# EAGLE design TXB0108PWR (EAGLE 7.1.0)
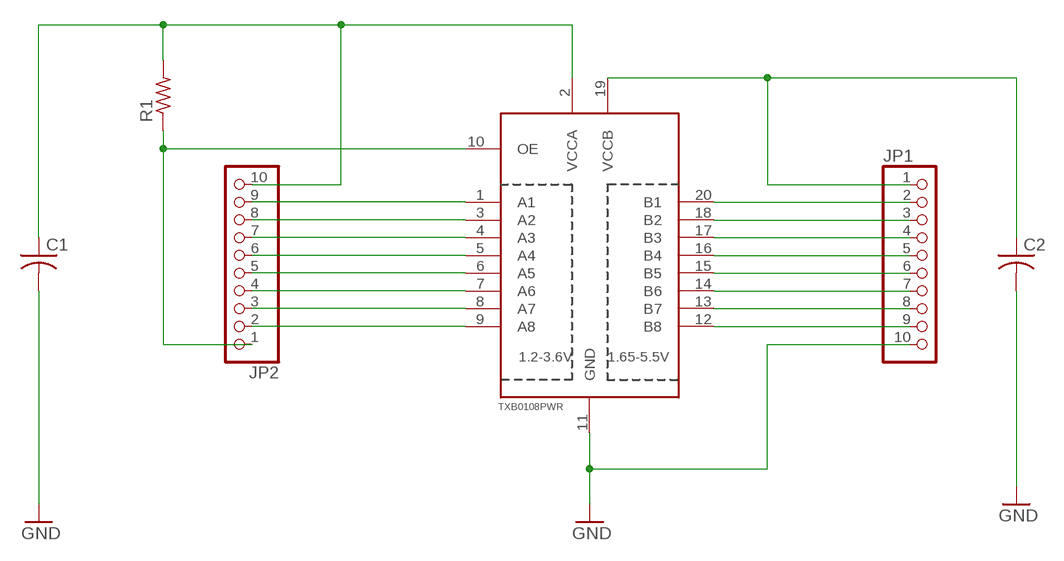
[diagram p0: schematic, sheet 1]

## Parts
C1  C-USC0603  [C0603]
C2  C-USC0603  [C0603]
JP1  PINHD-1X10  [1X10]
JP2  PINHD-1X10  [1X10]
R1  R-US_R0603  [R0603]
U$1  TXB0108PWR  [TXB0108PWR]

## Nets
B1: JP1.2 U$1.20(B1)
B2: JP1.3 U$1.18(B2)
B3: JP1.4 U$1.17(B3)
B4: JP1.5 U$1.16(B4)
B5: JP1.6 U$1.15(B5)
B6: JP1.7 U$1.14(B6)
B7: JP1.8 U$1.13(B7)
B8: JP1.9 U$1.12(B8)
GND: C1.2 C2.2 JP1.10 U$1.11(GND)
N$7: JP2.9 U$1.1(A1)
N$13: JP2.8 U$1.3(A2)
N$14: JP2.7 U$1.4(A3)
N$15: JP2.6 U$1.5(A4)
N$16: JP2.5 U$1.6(A5)
N$17: JP2.4 U$1.7(A6)
N$18: JP2.3 U$1.8(A7)
N$19: JP2.2 U$1.9(A8)
OE: JP2.1 R1.1 U$1.10(OE)
VCCA: C1.1 JP2.10 R1.2 U$1.2(VCCA)
VCCB: C2.1 JP1.1 U$1.19(VCCB)

## Library data of the parts
C1 C2 = rcl:C-US: CAPACITOR, American symbol
JP1 JP2 = pinhead:PINHD-1X10: PIN HEADER
R1 = rcl:R-US_: RESISTOR, American symbol
U$1 = TXB0108PWR:TXB0108PWR

## Board
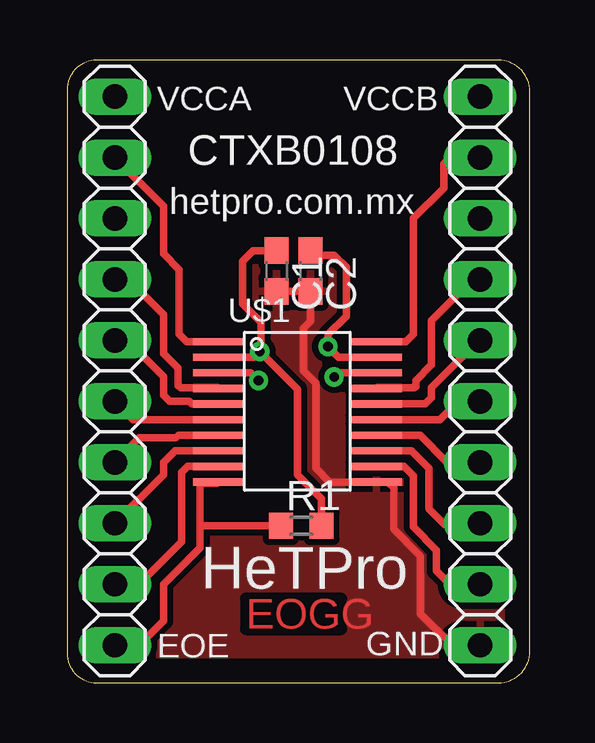
[diagram p1: board, top side]
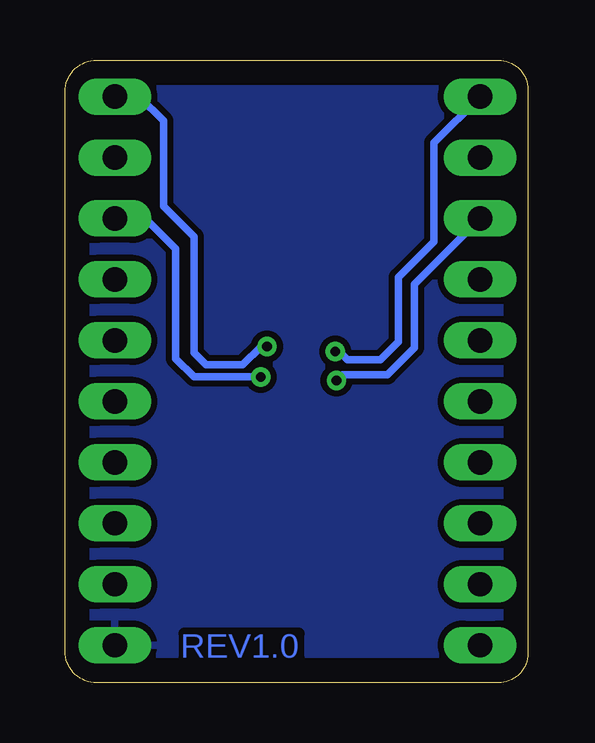
[diagram p2: board, bottom side, seen from below]

Size 19.29 x 25.94 mm. Coordinates in mm from the lower left corner, seen from the top.
Outline: 19.29,1.31 19.29,24.63 arc90 17.98,25.94 1.22,25.94 arc90 0,24.72 0,1.22 arc90 1.22,0 17.98,0 arc90 19.29,1.31
Copper layers (1*16): Top 0.035mm / dielectric 1.5mm / Bottom 0.035mm
Design rules "default": minimum track width 10mil, minimum drill 24mil, track to track 8mil, track to pad 8mil, pad to pad 8mil, via to via 8mil, smd to smd 8mil, copper to edge 40mil, drill to drill 8mil, minimum pad ring 10mil, minimum via ring 8mil, stop-mask expansion 4mil, vias tented up to drill 0mil, thermal gap 10mil

### Footprints (pad centres in the part's own frame; a part is rotated, then mirrored left to right if it is on the bottom)
C0603 = smd 1.1 x 1: 1 -0.85,0; 2 0.85,0
1X10 = drill 1.016 long: 1 -11.43,0; 2 -8.89,0; 3 -6.35,0; 4 -3.81,0; 5 -1.27,0; 6 1.27,0; 7 3.81,0; 8 6.35,0; 9 8.89,0; 10 11.43,0
R0603 = smd 1 x 1.1: 1 -0.85,0; 2 0.85,0
TXB0108PWR = smd 0.3 x 2.1: 1 0,0; 2 0.65,0; 3 1.3,0; 4 1.95,0; 5 2.6,0; 6 3.25,0; 7 3.9,0; 8 4.55,0; 9 5.2,0; 10 5.85,0; 11 5.85,6.6; 12 5.2,6.6; 13 4.55,6.6; 14 3.9,6.6; 15 3.25,6.6; 16 2.6,6.6; 17 1.95,6.6; 18 1.3,6.6; 19 0.65,6.6; 20 0,6.6

### Placement (x,y rotation side)
C1  8.72,17.16 270 top
C2  10.15,17.16 270 top
JP1  17.22,12.99 270 top
JP2  1.98,12.99 90 top
R1  9.75,6.54 0 top
U$1  6.3,14.21 270 top

### Tracks (layer width: path | path; a pad name or v marks a point on that pad's centre or on a via)
B1
  Top 0.305: U$1.20 14.12,14.21 14.43,14.52 14.43,19.34 15.7,20.61 15.7,21.63 15.95,21.88 JP1.2
B2  (via drill 0.4)
  Top 0.305: U$1.18 11.3,12.91 v11.12,12.74
  Bottom 0.305: v11.12,12.74 13.92,12.74 14.68,13.5 14.68,18.07 15.95,19.34 JP1.3
B3
  Top 0.305: U$1.17 12.92,12.28 14.48,12.28 14.53,12.33 14.53,12.59 15.19,13.25 15.19,15.08 16.91,16.8 JP1.4
B4
  Top 0.305: U$1.16 14.93,11.62 15.19,11.88 15.19,12.28 17.17,14.26 JP1.5
B5
  Top 0.305: U$1.15 15.54,10.96 16.31,11.72 JP1.6
B6
  Top 0.305: JP1.7 17.17,9.24 15.8,9.24 14.72,10.31 U$1.14
B7
  Top 0.305: JP1.8 17.17,6.59 15.75,6.59 15.09,7.25 15.09,8.93 14.35,9.66 U$1.13
B8
  Top 0.305: JP1.9 15.95,4.1 15.39,4.66 15.39,5.53 14.43,6.49 14.43,8.62 14.04,9.01 U$1.12
GND
  Top 0.305: JP1.10 16.05,1.56 14.73,2.89 14.73,5.27 13.61,6.39 13.61,8.12 13.37,8.36 U$1.11 10.93,8.36 10.36,8.93 10.36,12.49 9.85,12.99 9.85,14.77 10.15,15.06 C2.2 C1.2
  pour Top (isolate 0.254): -0.05,0.04 19.25,0.04 19.25,25.95 -0.05,25.95
  pour Bottom (isolate 0.254): -0.05,0.04 19.25,0.04 19.25,25.95 -0.05,25.95
N$7
  Top 0.305: U$1.1 4.98,14.21 4.67,14.52 4.67,17.21 4.01,17.87 4.01,19.85 JP2.9
N$13  (via drill 0.4)
  Top 0.305: U$1.3 7.65,12.91 v7.97,12.59
  Bottom 0.305: JP2.8 4.72,16.6 4.72,13.96 5.84,12.84 7.72,12.84 v7.97,12.59
N$14
  Top 0.305: U$1.4 6.28,12.28 4.72,12.28 4.62,12.38 4.62,13.1 4.01,13.71 4.01,15.33 2.54,16.8 JP2.7
N$15
  Top 0.305: U$1.5 5.18,11.62 5.08,11.72 4.27,11.72 4.01,11.98 4.01,12.74 2.49,14.26 JP2.6
N$16
  Top 0.305: JP2.5 2.74,10.96 U$1.6
N$17
  Top 0.305: JP2.4 3,10.2 4.52,10.2 4.63,10.31 U$1.7
N$18
  Top 0.305: JP2.3 4.01,8.68 4.01,9.18 4.49,9.66 U$1.8
N$19
  Top 0.305: JP2.2 3,4.1 4.77,5.88 4.77,8.78 5.01,9.01 U$1.9
OE
  Top 0.305: U$1.10 6.25,8.32 5.54,8.32 5.54,6.64 | 5.54,6.64 5.54,5.63 4.01,4.1 4.01,2.58 3,1.56 JP2.1 | R1.1 5.64,6.54 5.54,6.64
VCCA  (via drill 0.4)
  Top 0.305: U$1.2 7.78,13.56 v8.02,13.81 | R1.2 10.6,7.67 9.6,8.68 9.6,12.23 v8.02,13.81 | C1.1 7.76,18.01 7.31,17.57 7.31,15.79 8.08,15.03 8.08,13.86 v8.02,13.81
  Bottom 0.305: v8.02,13.81 7.87,13.81 7.52,13.45 6.15,13.45 5.38,14.21 5.38,16.91 3.91,18.38 3.91,22.49 JP2.10
VCCB  (via drill 0.4)
  Top 0.305: U$1.19 11.32,13.56 v10.87,14.01 10.87,14.52 11.63,15.28 11.63,17.31 11.12,17.82 10.33,17.82 C2.1
  Bottom 0.305: v10.87,14.01 11.12,14.01 11.89,13.25 13.41,13.25 13.92,13.76 13.92,18.58 15.19,19.85 15.19,23.41 16.2,24.42 JP1.1

### Text on the board
Top: EOGG
Bottom: REV1.0
tPlace: VCCB | VCCA | CTXB0108 | hetpro.com.mx | HeTPro | EOE | GND
tFinish: www.hetpro.com / contacto@hetpro.com